# Altium schematic sheet USB.SchDoc
size A
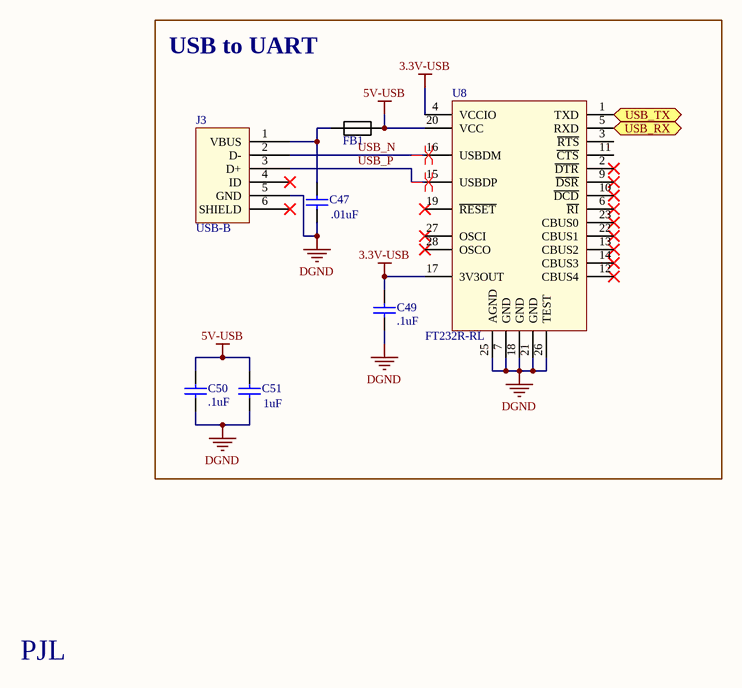
[diagram p0: USB.SchDoc]

## Parts
C47  .01uF  [CAPC1608XL]
C49  .1uF  [CAPC1608XN]
C50  .1uF  [CAPC1608XN]
C51  1uF  [CAPC1608XN]
FB1  FERRITE  [RESC2012X06N/0805]  (value not drawn)
J3  USB-B  [USB-MiniB-90]
U8  FT232R-RL  [SOP65P780X200-28L]

## Blocks framed on the sheet
USB to UART: C47 C49-C51 FB1 J3 U8

## Ports
USB_RX (in), USB_TX (out)

## Nets
3.3V-USB: C49.2 U8.4(VCCIO) U8.17(3V3OUT)
5V-USB: C50.2 C51.2 FB1.2 U8.20(VCC)
DGND: C47.1 C49.1 C50.1 C51.1 J3.5(GND) U8.7(GND) U8.18(GND) U8.21(GND) U8.25(AGND) U8.26(TEST)
USB_N: J3.2(D-) U8.16(USBDM)
USB_P: J3.3(D+) U8.15(USBDP)
USB_RX: U8.5(RXD) ; port USB_RX
USB_TX: U8.1(TXD) ; port USB_TX
NetC47_2: C47.2 FB1.1 J3.1(VBUS)

Not connected (* = marked no-connect by the designer): J3 4(ID)* 6(SHIELD)*; U8 2(~{DTR})* 3(~{RTS}) 6(~{RI})* 9(~{DSR})* 10(~{DCD})* 11(~{CTS}) 12(CBUS4)* 13(CBUS2)* 14(CBUS3)* 19(~{RESET})* 22(CBUS1)* 23(CBUS0)* 27(OSCI)* 28(OSCO)*

## Layout directives
differential pair: USB_N, USB_P

## Notes on the sheet
- PJL

## Library data of the parts
C47 = Capacitor: CAP CER 10000PF 16V 10% X7R 0603; Manufacturer Part Number: GRM188R71C103KA01D; Manufacturer: Murata Electronics North America; Package / Case: 0603 (1608 Metric); Voltage - Rated: 16V; Capacitance: 10000pF; Temperature Coefficient: X7R; Tolerance: ±10%; Supplier: Digi-Key; Supplier Part Number: 490-1525-1-ND
C49 C50 = CAP-CERAMIC-NP: CAP CER 0.1UF 10V 20% X7R 0603; Manufacturer Part Number: CX0603MRX7R6BB104; Manufacturer: Yageo; Capacitance: 0.1µF; Applications: Bypass, Decoupling; Operating Temperature: -55°C ~ 125°C; Tolerance: ±20%; Package / Case: 0603 (1608 Metric); Voltage - Rated: 10V; Temperature Coefficient: X7R; Supplier Part Number: 311-1237-1-ND; Supplier: Digi-Key
C51 = Capacitor: CAP CER 1UF 10V 10% X7R 0603; Manufacturer Part Number: GRM188R71A105KA61D; Manufacturer: Murata Electronics North America; Capacitance: 1.0µF; Tolerance: ±10%; Supplier: Digi-Key; Temperature Coefficient: X7R; Package / Case: 0603 (1608 Metric); Voltage - Rated: 10V; Supplier Part Number: 490-3899-1-ND
FB1 = FERRITE: FERRITE BEAD 60 OHM 3.0A 0805; Manufacturer: Wurth Electronics Inc; Manufacturer Part Number: 742792063; Current Rating: 3A; Package / Case: 0805 (2012 Metric); Supplier Part Number: 732-1612-1-ND; Supplier: Digi-Key
J3 = USB-B: CONN MINI USB RCPT RA TYPE B SMD; Manufacturer: TE Connectivity; Manufacturer Part Number: 1734035-2; Mounting Type: Surface Mount, Right Angle, Horizontal; Supplier: Digi-Key; Supplier Part Number: A31727CT-ND
U8 = FT232R-RL: IC USB FS SERIAL UART 28-SSOP; Manufacturer: FTDI, Future Technology Devices International Ltd; Manufacturer Part Number: FT232RL-REEL; Protocol: RS232, RS422, RS485; Voltage - Supply: 3.3 V ~ 5.25 V; Package / Case: 28-SSOP (0.209", 5.30mm Width); Supplier Part Number: 768-1007-1-ND; Supplier: Digi-Key